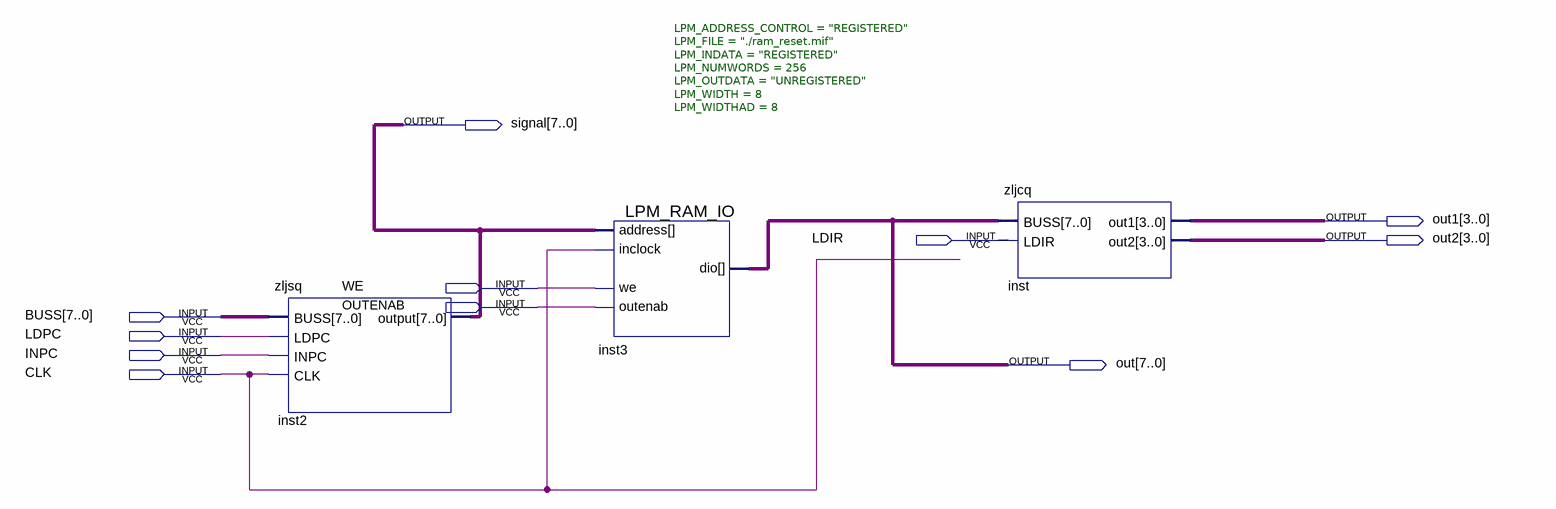
[diagram p0: schematic sheet]
// Quartus schematic part1.bdf as structural Verilog: 3 symbols, 11 pins
module part1 (
  input  LDIR,
  input  WE,
  input  OUTENAB,
  input  [7:0] BUSS,
  input  LDPC,
  input  INPC,
  input  CLK,
  output [7:0] signal,
  output [3:0] out1,
  output [3:0] out2,
  output [7:0] out
);

  zljsq inst2 (.BUSS(BUSS), .LDPC(LDPC), .INPC(INPC), .CLK(CLK), .\output (signal));
  LPM_RAM_IO #(.LPM_ADDRESS_CONTROL("REGISTERED"), .LPM_FILE("./ram_reset.mif"), .LPM_INDATA("REGISTERED"), .LPM_NUMWORDS(256), .LPM_OUTDATA("UNREGISTERED"), .LPM_WIDTH(8), .LPM_WIDTHAD(8)) inst3 (
    .address(signal), .inclock(CLK), .we(WE), .outenab(OUTENAB), .dio(out));
  zljcq inst (.BUSS(out), .LDIR(LDIR), .out1(out1), .out2(out2));
endmodule
